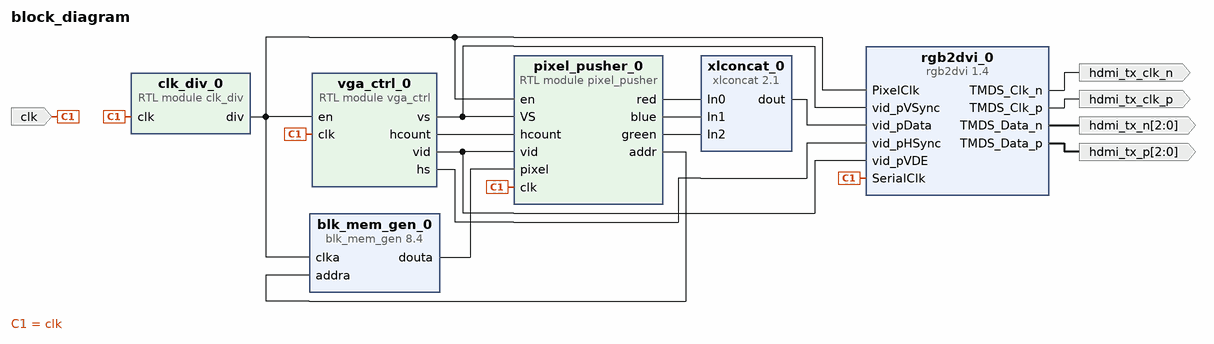
[diagram p0: block diagram of the top level]
# Vivado block design block_diagram, xc7z010clg400-1, Vivado 2018.2
create_bd_design block_diagram

create_bd_port -dir I -type clk clk
set_property -dict {CONFIG.FREQ_HZ 125000000} [get_bd_ports clk]
create_bd_port -dir O -type clk hdmi_tx_clk_p
create_bd_port -dir O -type clk hdmi_tx_clk_n
create_bd_port -dir O -from 2 -to 0 hdmi_tx_p
create_bd_port -dir O -from 2 -to 0 hdmi_tx_n

create_bd_cell -type ip -vlnv digilentinc.com:ip:rgb2dvi:1.4 rgb2dvi_0
set_property -dict {CONFIG.kGenerateSerialClk false} [get_bd_cells rgb2dvi_0]
create_bd_cell -type ip -vlnv xilinx.com:ip:blk_mem_gen:8.4 blk_mem_gen_0
create_bd_cell -type module -reference clk_div clk_div_0
create_bd_cell -type module -reference vga_ctrl vga_ctrl_0
create_bd_cell -type ip -vlnv xilinx.com:ip:xlconcat:2.1 xlconcat_0
set_property -dict {CONFIG.NUM_PORTS 3 CONFIG.IN0_WIDTH 8 CONFIG.IN1_WIDTH 8 CONFIG.IN2_WIDTH 8} [get_bd_cells xlconcat_0]
create_bd_cell -type module -reference pixel_pusher pixel_pusher_0

# ---- connections ----

connect_bd_net [get_bd_pins clk_div_0/div] \
  [get_bd_pins blk_mem_gen_0/clka] [get_bd_pins rgb2dvi_0/PixelClk] [get_bd_pins vga_ctrl_0/en] \
  [get_bd_pins pixel_pusher_0/en]
connect_bd_net [get_bd_pins vga_ctrl_0/hs] [get_bd_pins rgb2dvi_0/vid_pHSync]
connect_bd_net [get_bd_pins vga_ctrl_0/vs] [get_bd_pins rgb2dvi_0/vid_pVSync] [get_bd_pins pixel_pusher_0/VS]
connect_bd_net [get_bd_pins vga_ctrl_0/vid] [get_bd_pins rgb2dvi_0/vid_pVDE] [get_bd_pins pixel_pusher_0/vid]
connect_bd_net [get_bd_pins pixel_pusher_0/addr] [get_bd_pins blk_mem_gen_0/addra]
connect_bd_net [get_bd_pins blk_mem_gen_0/douta] [get_bd_pins pixel_pusher_0/pixel]
connect_bd_net [get_bd_pins vga_ctrl_0/hcount] [get_bd_pins pixel_pusher_0/hcount]
connect_bd_net -net clk_100MHz_1 [get_bd_ports clk] \
  [get_bd_pins clk_div_0/clk] [get_bd_pins rgb2dvi_0/SerialClk] [get_bd_pins vga_ctrl_0/clk] [get_bd_pins pixel_pusher_0/clk]
connect_bd_net [get_bd_pins rgb2dvi_0/TMDS_Clk_p] [get_bd_ports hdmi_tx_clk_p]
connect_bd_net [get_bd_pins rgb2dvi_0/TMDS_Clk_n] [get_bd_ports hdmi_tx_clk_n]
connect_bd_net [get_bd_pins rgb2dvi_0/TMDS_Data_p] [get_bd_ports hdmi_tx_p]
connect_bd_net [get_bd_pins rgb2dvi_0/TMDS_Data_n] [get_bd_ports hdmi_tx_n]
connect_bd_net [get_bd_pins pixel_pusher_0/red] [get_bd_pins xlconcat_0/In0]
connect_bd_net [get_bd_pins pixel_pusher_0/blue] [get_bd_pins xlconcat_0/In1]
connect_bd_net [get_bd_pins pixel_pusher_0/green] [get_bd_pins xlconcat_0/In2]
connect_bd_net [get_bd_pins xlconcat_0/dout] [get_bd_pins rgb2dvi_0/vid_pData]

validate_bd_design
save_bd_design
